# Altium schematic sheet led board.SchDoc
size A4
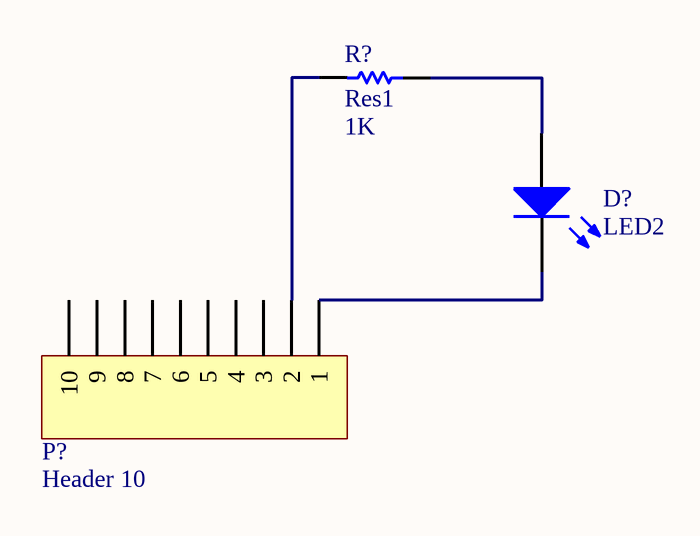
[diagram p0: led board.SchDoc]

## Parts
D?  LED2  [3.2X1.6X1.1]
P?  Header 10  [HDR1X10]
R?  Res1  value 1K  [AXIAL-0.3]

## Nets
NetD?_1: D?.1(A) R?.1
NetD?_2: D?.2(K) P?.1
NetP?_2: P?.2 R?.2

Not connected (* = marked no-connect by the designer): P? 3 4 5 6 7 8 9 10

## Library data of the parts
D? = LED2: Typical RED, GREEN, YELLOW, AMBER GaAs LED; Published: 8-Jun-2000; LatestRevisionDate: 17-Jul-2002; LatestRevisionNote: Re-released for DXP Platform.; PackageVersion: Feb-2002; PackageReference: 3.2X1.6X1.1; Publisher: Altium Limited; PackageDescription: SM LED; 2 Flat Leads
P? = Header 10: Header, 10-Pin; LatestRevisionDate: 17-Jul-2002; LatestRevisionNote: Re-released for DXP Platform.; Publisher: Altium Limited
R? = Res1: Resistor; Published: 8-Jun-2000; LatestRevisionDate: 17-Jul-2002; LatestRevisionNote: Re-released for DXP Platform.; PackageReference: AXIAL-0.3; Publisher: Altium Limited; PackageDescription: Axial Device, Thru-Hole; 2 Leads; 0.3 in Pin Spacing